# Altium schematic sheet Combined.SchDoc
size A
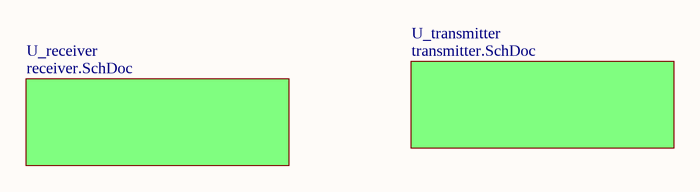
[diagram p0: Combined.SchDoc]

## Sub-sheets
U_receiver = receiver.SchDoc: no entries
U_transmitter = transmitter.SchDoc: no entries